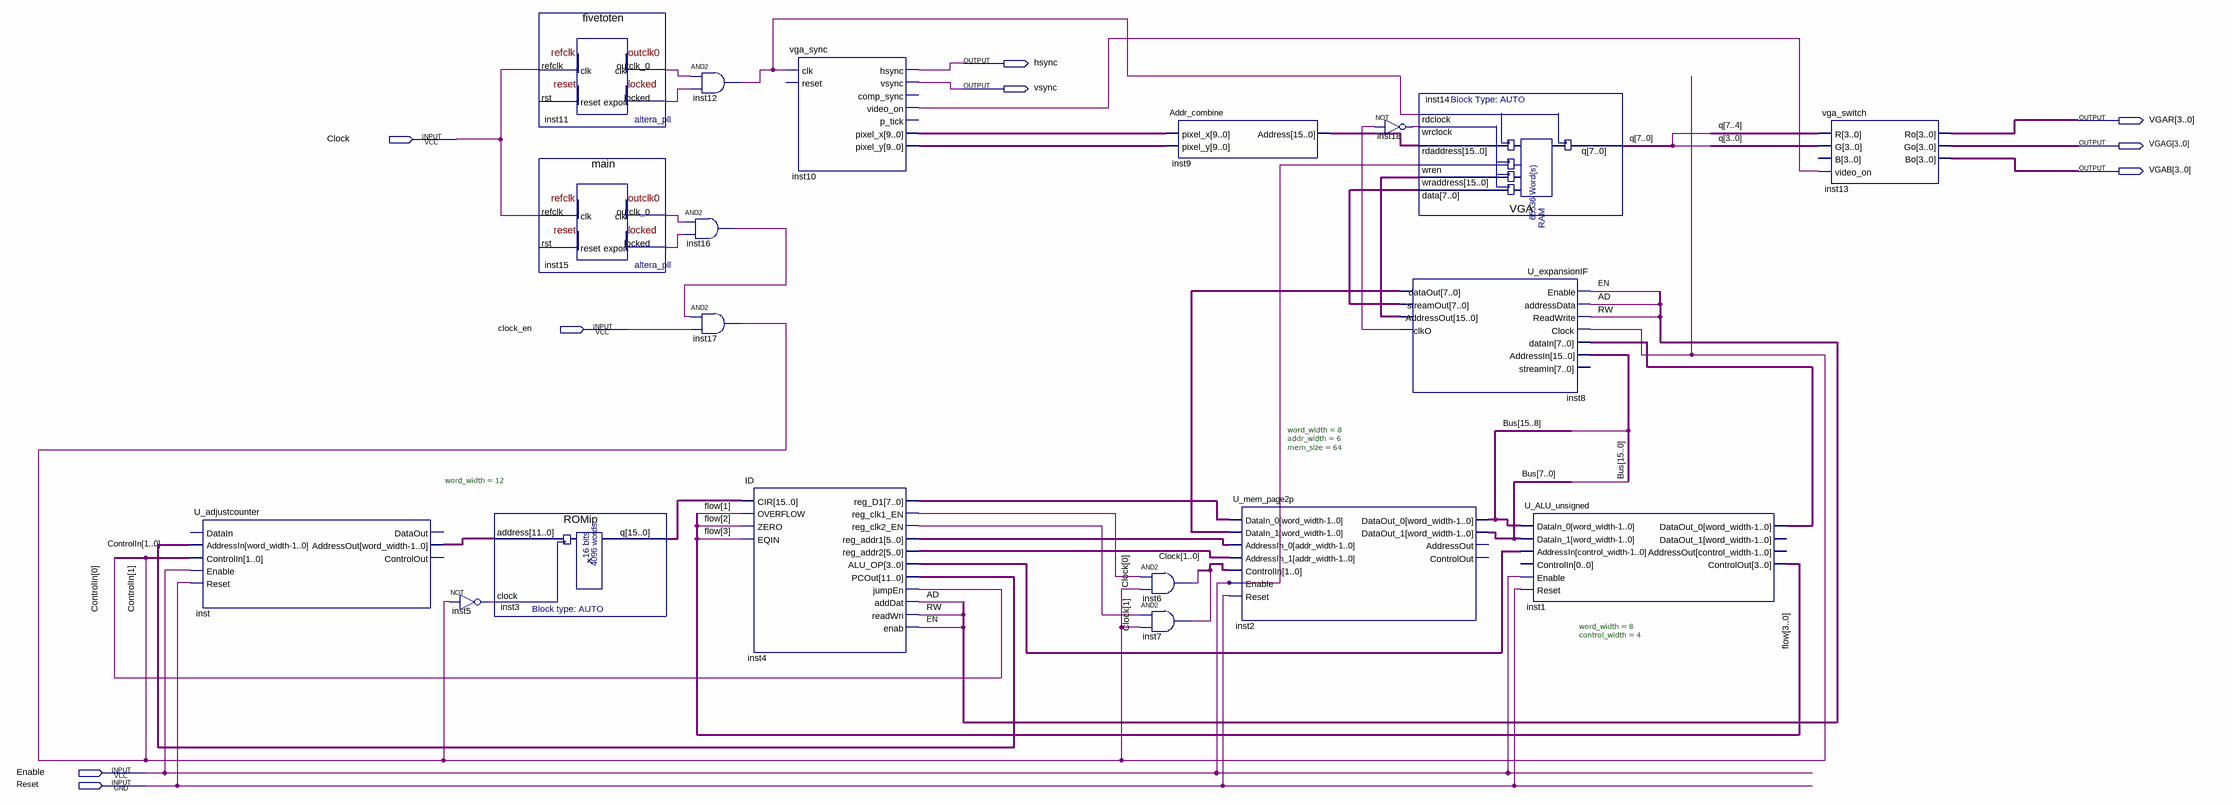
[diagram p0: schematic sheet]
// Quartus schematic K1mod.bdf as structural Verilog: 19 symbols, 9 pins
module K1mod (
  input  Clock,
  input  clock_en,
  input  Enable,
  input  Reset,
  output hsync,
  output vsync,
  output [3:0] VGAR,
  output [3:0] VGAG,
  output [3:0] VGAB
);

  wire AD, EN, inst4_reg_clk1_en, inst4_reg_clk2_en, inst5_out, inst8_clko, inst10_video_on, inst11_locked,
       inst11_outclk_0, inst12_out, inst15_locked, inst15_outclk_0, inst16_out, inst18_out, RW;
  wire [1:0] Clock_bus, ControlIn;
  wire [3:0] flow, inst4_alu_op;
  wire [5:0] inst4_reg_addr1, inst4_reg_addr2;
  wire [7:0] inst1_dataout_0, inst4_reg_d1, inst8_dataout, inst8_streamout, q;
  wire [9:0] inst10_pixel_x, inst10_pixel_y;
  wire [11:0] inst4_pcout, inst_addressout;
  wire [15:0] Bus, inst3_q, inst8_addressout, inst9_address;

  U_adjustcounter #(.word_width(12)) inst (
    .AddressIn(inst4_pcout), .ControlIn(ControlIn), .Enable(Enable), .Reset(Reset),
    .AddressOut(inst_addressout));  // open: DataIn, DataOut, ControlOut
  not inst5 (inst5_out, ControlIn[1]);
  ROMip inst3 (.address(inst_addressout), .clock(inst5_out), .q(inst3_q));
  fivetoten inst11 (.refclk(Clock), .outclk_0(inst11_outclk_0), .locked(inst11_locked));  // open: rst
  main inst15 (.refclk(Clock), .outclk_0(inst15_outclk_0), .locked(inst15_locked));  // open: rst
  and inst16 (inst16_out, inst15_outclk_0, inst15_locked);
  and inst12 (inst12_out, inst11_outclk_0, inst11_locked);
  and inst17 (ControlIn[1], inst16_out, clock_en);
  vga_sync inst10 (
    .clk(inst12_out), .hsync(hsync), .vsync(vsync), .video_on(inst10_video_on), .pixel_x(inst10_pixel_x),
    .pixel_y(inst10_pixel_y));  // open: reset, comp_sync, p_tick
  ID inst4 (
    .CIR(inst3_q), .OVERFLOW(flow[1]), .ZERO(flow[2]), .EQIN(flow[3]), .reg_D1(inst4_reg_d1),
    .reg_clk1_EN(inst4_reg_clk1_en), .reg_clk2_EN(inst4_reg_clk2_en), .reg_addr1(inst4_reg_addr1),
    .reg_addr2(inst4_reg_addr2), .ALU_OP(inst4_alu_op), .PCOut(inst4_pcout), .addDat(AD), .readWri(RW),
    .enab(EN), .jumpEn(ControlIn[0]));
  and inst6 (Clock_bus[0], inst4_reg_clk1_en, ControlIn[1]);
  and inst7 (Clock_bus[1], inst4_reg_clk2_en, ControlIn[1]);
  Addr_combine inst9 (.pixel_x(inst10_pixel_x), .pixel_y(inst10_pixel_y), .Address(inst9_address));
  U_mem_page2p #(.word_width(8), .addr_width(6), .mem_size(64)) inst2 (
    .DataIn_0(inst4_reg_d1), .DataIn_1(inst8_dataout), .AddressIn_0(inst4_reg_addr1),
    .AddressIn_1(inst4_reg_addr2), .ControlIn(Clock_bus), .Enable(Enable), .Reset(Reset),
    .DataOut_0(Bus[15:8]), .DataOut_1(Bus[7:0]));  // open: AddressOut, ControlOut
  not inst18 (inst18_out, inst8_clko);
  VGA inst14 (
    .data(inst8_streamout), .wraddress(inst8_addressout), .wren(Enable), .rdaddress(inst9_address),
    .wrclock(inst18_out), .rdclock(inst12_out), .q(q));
  U_expansionIF inst8 (
    .Enable(EN), .addressData(AD), .ReadWrite(RW), .Clock(ControlIn[1]), .dataIn(inst1_dataout_0),
    .AddressIn(Bus), .dataOut(inst8_dataout), .streamOut(inst8_streamout), .AddressOut(inst8_addressout),
    .clkO(inst8_clko));  // open: streamIn
  U_ALU_unsigned #(.word_width(8), .control_width(4)) inst1 (
    .DataIn_0(Bus[15:8]), .DataIn_1(Bus[7:0]), .AddressIn(inst4_alu_op), .Enable(Enable), .Reset(Reset),
    .DataOut_0(inst1_dataout_0), .ControlOut(flow));  // open: ControlIn, DataOut_1, AddressOut
  vga_switch inst13 (.R(q[7:4]), .G(q[3:0]), .video_on(inst10_video_on), .Ro(VGAR), .Go(VGAG), .Bo(VGAB));  // open: B
endmodule
